# Altium project Task1.PrjPcb
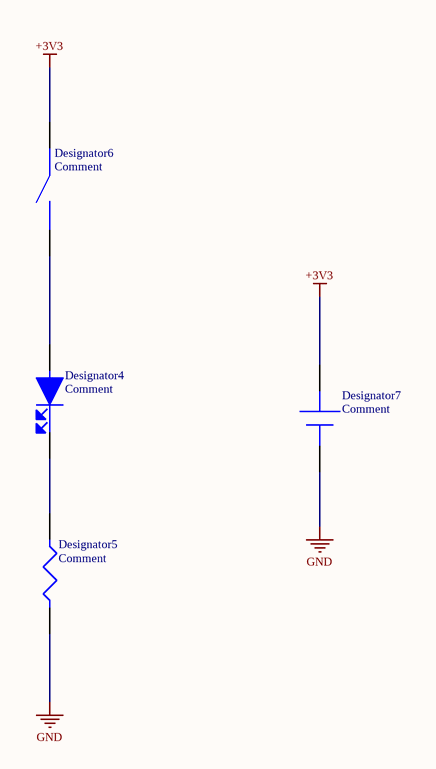
[diagram p0: Task1.SchDoc]
1 sheet, 4 parts. Net scope: global (net labels, ports and power ports of the same name join across sheets).
Board file: Task1.PcbDoc

## Sheet Task1.SchDoc
size A4; SheetNumber: 1; SheetTotal: 1

### Parts
Designator4  Comment  [LED]
Designator5  Comment  [Resistor]
Designator6  Comment  [Switch]
Designator7  Comment  [Terminal]

### Nets
+3V3: Designator6.1 Designator7.2
GND: Designator5.2 Designator7.1
NetDesignator4_1: Designator4.1 Designator5.1
NetDesignator4_2: Designator4.2 Designator6.2

### Library data of the parts
Designator4 = LED: LED GREEN CLEAR 3528 SMD; Part Number: 732-4997-1-ND; ComponentLink1Description: DigiKey; ComponentLink1URL: https://www.digikey.com/en/products/detail/w%C3%BCrth-elektronik/150141GS73100/4489957
Designator5 = Resistor: RES SMD 230OHM 0.01% 1/4W J LEAD /; Part Number: Y1121230R000T9L-ND; ComponentLink1Description: DigiKey; ComponentLink1URL: https://www.digikey.com/en/products/detail/vpg-foil-resistors/Y1121230R000T9L/4225988
Designator6 = Switch: SWITCH TOGGLE SPDT 0.4VA 28V; Part Key: 360-1774-ND; ComponentLink1Description: DigiKey; ComponentLink1URL: https://www.digikey.com/en/products/detail/nkk-switches/G3T12AP/1006855
Designator7 = Terminal: Screw Terminals 3.5mm Pitch (2-Pin); Part Number: PRT-08084 RoHS; ComponentLink1Description: SparkFun; ComponentLink1URL: https://www.sparkfun.com/products/8084